# EAGLE design fb_up_2-4fach_tastsensor_mirr (EAGLE 5.00)
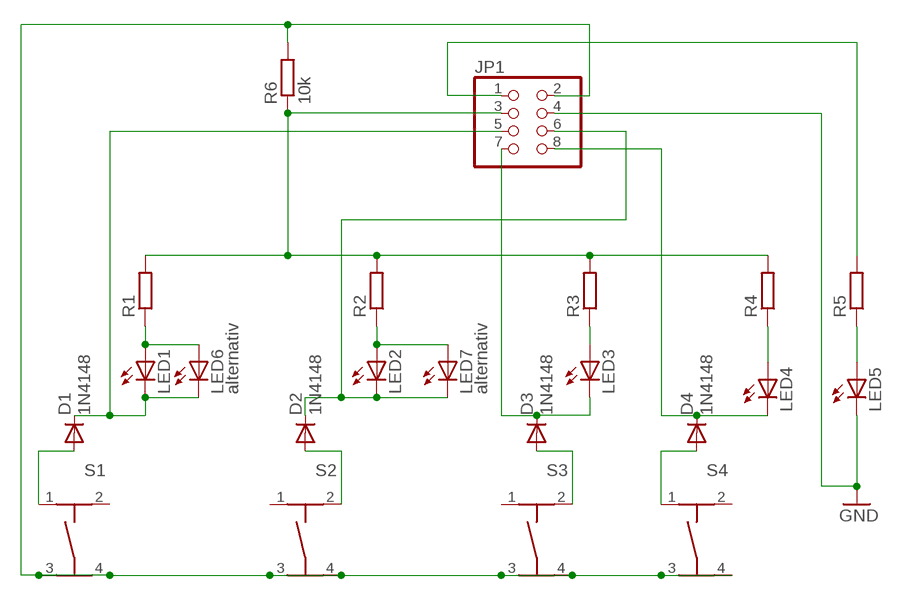
[diagram p0: schematic, sheet 1]

## Parts
D1  1N4148  [DO35-10]
D2  1N4148  [DO35-10]
D3  1N4148  [DO35-10]
D4  1N4148  [DO35-10]
JP1  PINHD-2X4  [2X04]
LED1  LED3MM  [LED3MM]
LED2  LED3MM  [LED3MM]
LED3  LED3MM  [LED3MM]
LED4  LED3MM  [LED3MM]
LED5  LED3MM  [LED3MM]
LED6  alternativ  LED3MM  [LED3MM]
LED7  alternativ  LED3MM  [LED3MM]
R1  R-EU_0204/7  [0204/7]
R2  R-EU_0204/7  [0204/7]
R3  R-EU_0204/7  [0204/7]
R4  R-EU_0204/7  [0204/7]
R5  R-EU_0204/7  [0204/7]
R6  10k  R-EU_0204/7  [0204/7]
S1  TASTER-9314_SMD  [TASTER-9314_SMD]
S2  TASTER-9314_SMD  [TASTER-9314_SMD]
S3  TASTER-9314_SMD  [TASTER-9314_SMD]
S4  TASTER-9314_SMD  [TASTER-9314_SMD]

## Nets
GND: JP1.4 LED5.K(C)
N$4: JP1.1 R5.2
N$5: LED1.A LED6.A R1.1
N$6: LED2.A LED7.A R2.1
N$7: LED3.A R3.1
N$8: LED4.A R4.1
N$9: LED5.A R5.1
N$10: JP1.3 R1.2 R2.2 R3.2 R4.2 R6.1
N$11: D1.C JP1.5 LED1.K(C) LED6.K(C)
N$12: D2.C JP1.6 LED2.K(C) LED7.K(C)
N$13: D1.A S1.1
N$14: D4.C JP1.8 LED4.K(C)
N$15: JP1.2 R6.2 S1.3 S1.4 S2.3 S2.4 S3.3 S3.4 S4.3 S4.4
N$17: D2.A S2.2
N$19: D3.C JP1.7 LED3.K(C)
N$21: D3.A S3.2
N$23: D4.A S4.1
Unconnected: S1.2 S2.1 S3.1 S4.2

## Library data of the parts
D1-D4 = diode:1N4148: DIODE high speed (Philips)
JP1 = pinhead:PINHD-2X4: PIN HEADER
LED1-LED7 = led:LED: LED OSRAM: - CHIPLED LG R971, LG N971, LY N971, LG Q971, LY Q971, LO R971, LY R971 LH N974, LH R974 LS Q976, LO Q976, LY Q976 LO Q996 - Hyper CHIPLED LW Q18S LB Q993, LB Q99A, LB R99A - SideLED LS A670, LO A670, LY A670, LG A670, LP A670 LB A673, LV A673, LT A673, LW A673 LH A674 LY A675 LS A676, LA A676, LO A676, LY A676, LW A676 LS A679, LY A679, LG A679 - Hyper Micro SIDELED® LS Y876, LA Y876, LO Y876, LY Y876 LT Y87S - SmartLED LW L88C, LW L88S LB L89C, LB L89S, LG L890 LS L89K, LO L89K, LY L89K LS L896, LA L896, LO L896, LY L896 - TOPLED LS T670, LO T670, LY T670, LG T670, LP T670 LSG T670, LSP T670, LSY T670, LOP T670, LYG T670 LG T671, LOG T671, LSG T671 LB T673, LV T673, LT T673, LW T673 LH T674 LS T676, LA T676, LO T676, LY T676, LB T676, LH T676, LSB T676, LW T676 LB T67C, LV T67C, LT T67C, LS T67K, LO T67K, LY T67K, LW E67C LS E67B, LA E67B, LO E67B, LY E67B, LB E67C, LV E67C, LT E67C LW T67C LS T679, LY T679, LG T679 LS T770, LO T770, LY T770, LG T770, LP T770 LB T773, LV T773, LT T773, LW T773 LH T774 LS E675, LA E675, LY E675, LS T675 LS T776, LA T776, LO T776, LY T776, LB T776 LHGB T686 LT T68C, LB T68C - Hyper Mini TOPLED® LB M676 - Mini TOPLED Santana® LG M470 LS M47K, LO M47K, LY M47K Source: http://www.osram.convergy.de/
R1-R6 = rcl:R-EU_: RESISTOR, European symbol
S1-S4 = Ergaenzung:TASTER-9314_SMD

## Board
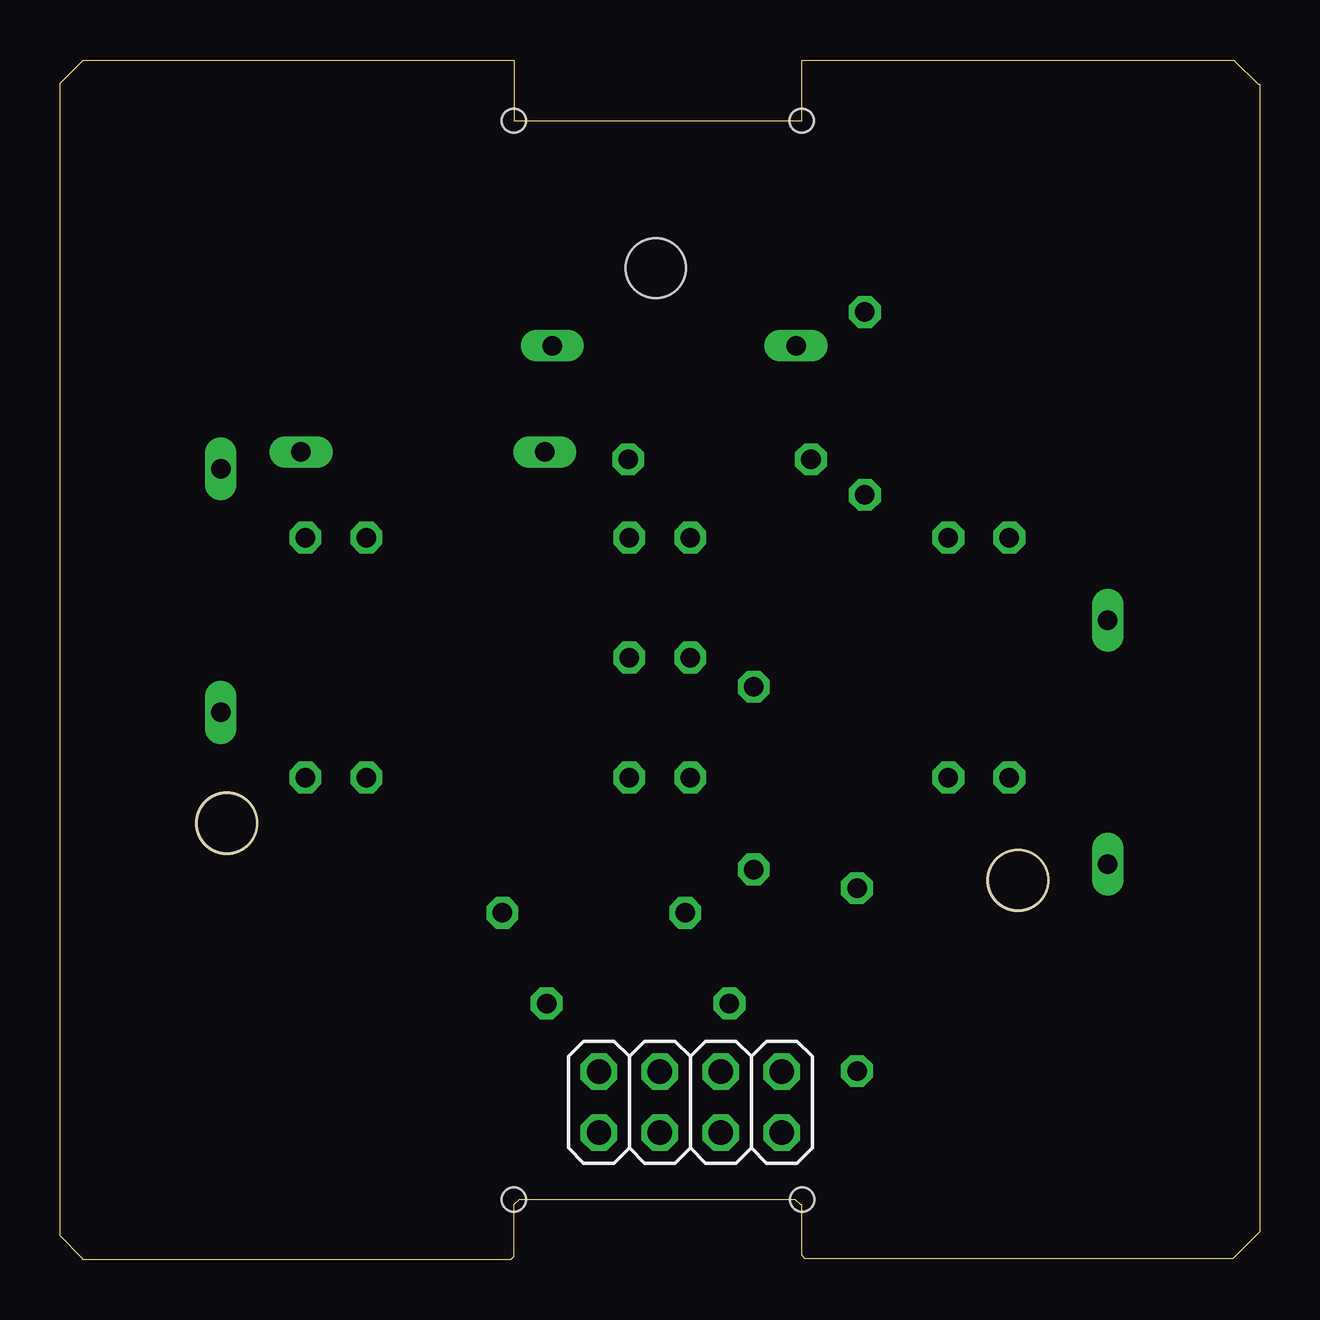
[diagram p1: board, top side]
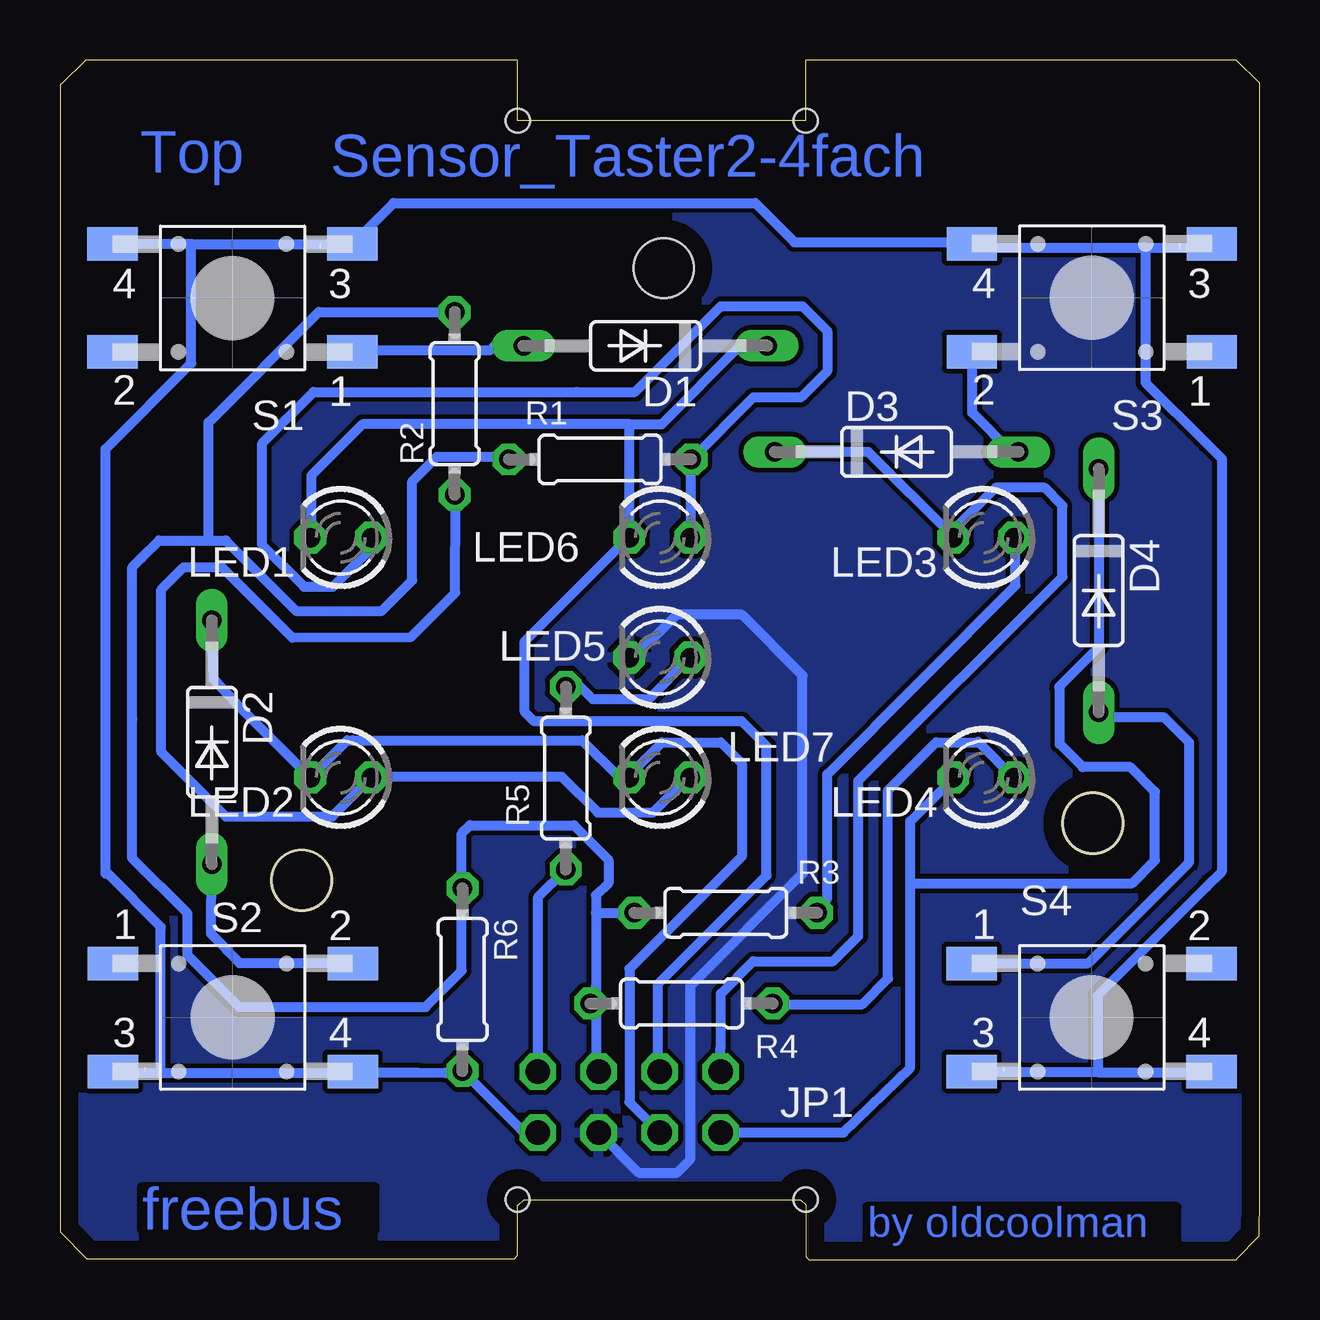
[diagram p2: board, bottom side, seen from below]

Size 50 x 50.01 mm. Coordinates in mm from the lower left corner, seen from the top.
Outline: 50,1.17 48.88,0.05 31.06,0.05 30.93,0.18 30.93,2.29 30.88,2.29 30.66,2.51 19.13,2.51 18.91,2.29 18.91,0.13 18.78,0 0.95,0 0.95,0.05 0.01,0.99 0,2.6 0,47.6 0,49.05 0.96,50.01 18.93,50.01 18.93,47.48 30.92,47.48 30.92,50.01 48.92,50.01 49.94,48.99 50,48.99 50,47.6 50,47.6 50,1.17
Outline: circle at 39.93,15.81 radius 1.3
Outline: circle at 6.95,18.2 radius 1.3
Copper layers (1*16): Top 0.035mm / dielectric 1.5mm / Bottom 0.035mm
Design rules "default *": minimum track width 10mil, minimum drill 24mil, track to track 8mil, track to pad 8mil, pad to pad 8mil, via to via 8mil, smd to smd 8mil, copper to edge 30mil, drill to drill 8mil, minimum pad ring 10mil, minimum via ring 8mil, stop-mask expansion 4mil, vias tented up to drill 0mil, thermal gap 10mil
Holes 2.5 mm at 24.84,41.33 39.93,15.82 6.95,18.2
Holes 1 mm at 30.91,47.48 18.92,47.48 30.93,2.51 18.92,2.51
tKeepout: area 16.2,46.6 to 33.7,47.6; area 0,2.7 to 4,47.6; area 0.1,2.6 to 50,3.6; area 45.8,2.7 to 50,47.6; area 39.6,40.9 to 45.9,47.5; area 36.2,44.3 to 39.6,47.6; area 34.5,45.8 to 36.2,47.6; area 43,37.5 to 45.8,40.9; area 44.6,36 to 45.8,37.5; area 41.4,39.2 to 42.9,40.8; area 37.9,42.5 to 39.6,44.3; area 40.8,3.5 to 45.9,10.3; 25 more areas; 10 lines
bKeepout: area 18.3,20.6 to 19.6,23.8; area 30.5,20.6 to 31.8,30.5; area 45,19.8 to 50,29.8; area 30.5,19.8 to 35.5,29.8; area 14.6,19.8 to 19.6,29.8; area 0,19.8 to 5,29.8; area 0,2.6 to 50,5.3; area 0,44.8 to 50,47.6; area 22.4,40.9 to 27.4,41.8; area 39.4,13.6 to 40.5,18; area 6.5,16 to 7.5,20.4; area 47.8,2.6 to 50,47.6; 1 more areas

### Footprints (pad centres in the part's own frame; a part is rotated, then mirrored left to right if it is on the bottom)
DO35-10 = drill 0.813 long: A 5.08,0; C -5.08,0
2X04 = drill 1.016 octagon: 1 -3.81,-1.27; 2 -3.81,1.27; 3 -1.27,-1.27; 4 -1.27,1.27; 5 1.27,-1.27; 6 1.27,1.27; 7 3.81,-1.27; 8 3.81,1.27
LED3MM = drill 0.813 octagon: A -1.27,0; K 1.27,0
0204/7 = drill 0.813 octagon: 1 -3.81,0; 2 3.81,0
TASTER-9314_SMD = smd 2.1 x 1.4: 1 -5,2.25; 2 5,2.25; 3 -5,-2.25; 4 5,-2.25

### Placement (x,y rotation side)
D1  25.6,38.09 180 bottom
D2  43.67,21.58 270 bottom
D3  15.13,33.67 0 bottom
D4  6.71,27.89 270 bottom
JP1  26.28,6.57 180 top
LED1  38.3,30.1 180 bottom
LED2  38.3,20.1 180 bottom
LED3  11.5,30.1 180 bottom
LED4  11.5,20.1 180 bottom
LED5  25,25.1 180 bottom
LED6  25,30.1 180 bottom
LED7  25,20.1 180 bottom
R1  27.49,33.36 180 bottom
R2  33.55,35.69 90 bottom
R3  22.25,14.46 180 bottom
R4  24.09,10.69 180 bottom
R5  28.91,20.08 270 bottom
R6  33.22,11.68 270 bottom
S1  42.81,40.09 180 bottom
S2  42.8,10.1 0 bottom
S3  6.99,40.1 180 bottom
S4  7,10.1 0 bottom

### Tracks (layer width: path | path; a pad name or v marks a point on that pad's centre or on a via)
GND
  Bottom 0.406: LED5.K 26.07,25.1 24.28,26.89 21.58,26.89 19.04,24.35 19.04,16.09 23.73,11.41 23.73,4.19 24.28,3.63 25.88,3.63 27.55,5.31 JP1.4
  pour Bottom: 50.95,50.94 -1.59,50.94 -1.59,-0.42 50.79,-0.42 50.79,31.41
N$1  (via drill 0.6)
  other vias: 24.87,41.33
N$2  (via drill 0.6)
  other vias: 39.93,15.81
N$3  (via drill 0.6)
  other vias: 6.95,18.2
N$4
  Bottom 0.406: R5.2 30.07,15.12 30.07,8.61 JP1.1
N$5
  Bottom 0.406: 36.92,30.12 37.02,30.12 LED1.A 37.06,30.13 | LED6.A 23.72,33.04 23.72,33.31 23.73,33.32 R1.1 21.11,35.94 19.12,35.94 18.01,37.05 18.01,38.72 19.04,39.75 22.46,39.75 26.04,36.17 28.46,36.17 39.44,36.17 41.57,34.03 41.57,29.8 39.83,28.05 38.62,28.05 37.06,29.62 37.06,30.13 | 37.06,30.13 37.06,30.21
N$6
  Bottom 0.406: LED7.A 23.72,20.09 23.72,19.98 23.94,19.98 25.29,18.64 27.58,18.64 29.09,20.14 36.99,20.14 LED2.A 38.65,18.48 43.09,18.48 45.78,21.16 45.78,27.93 44.84,28.87 43.25,28.87 40.32,25.94 35.36,25.97 33.53,27.79 33.51,31.67 33.55,31.83 R2.1
N$7
  Bottom 0.406: R3.1 18.02,15.07 18.02,20.23 10.17,28.11 10.17,30.04 LED3.A
N$8
  Bottom 0.406: R4.1 19.92,10.65 16.56,10.65 15.49,11.73 15.49,19.57 13.49,21.57 11.74,21.57 11.73,21.58 11.73,21.59 10.17,20.03 10.27,20.03 10.27,20.06 LED4.A
N$9
  Bottom 0.406: LED5.A 25.46,23.37 27.8,23.37 28.34,23.91 28.89,23.91 R5.1
N$10
  Bottom 0.406: 27.67,11.32 27.67,11.39 | JP1.3 27.67,8.35 27.67,11.32 | 27.67,11.32 R4.2 | 27.67,14.45 27.67,15.19 27.14,15.69 27.14,16.67 28.57,18.11 32.91,18.11 33.25,17.76 33.25,15.49 R6.1 | 27.67,14.45 27.67,11.32 | 27.67,14.45 27.49,14.45 | R3.2 26.79,14.45 27.67,14.45 | R1.2 31.3,33.43 31.35,33.48 34.28,33.48 35.32,32.45 35.32,28.32 36.59,27.05 40.16,27.05 43.09,29.98 43.81,29.98 | R2.2 39.21,39.5 43.81,34.91 43.81,29.98 | 43.81,29.98 45.87,29.98 46.59,29.27 | 46.59,29.27 | 46.59,29.27 46.98,28.87 46.98,22.52 46.98,16.73 44.68,14.43 44.68,12.68 42.54,10.54 34.76,10.54 33.25,12.05 33.25,15.46 R6.1 | R6.1
N$11
  Bottom 0.406: LED1.K 39.6,30.14 39.52,30.22 39.52,32.68 37.38,34.83 26.27,34.83 | 25.02,8.19 25.1,7.9 JP1.5 25,7.92 25.08,7.6 25.08,11.49 20.55,16.01 20.55,21.41 21.58,22.44 30.24,22.44 30.63,22.84 30.63,25.78 26.27,30.14 | D1.C 21.65,38.09 24.92,34.83 26.27,34.83 | 26.27,34.83 26.27,34.75 26.27,34.74 LED6.K 26.27,30.14 | 26.27,30.14
N$12
  Bottom 0.406: D2.C 43.6,24.19 42.64,23.17 LED2.K 38.28,21.39 38.03,21.65 37.8,21.65 28.23,21.65 26.72,20.14 26.3,20.14 26.3,20.13 LED7.K 26.27,20.22 24.92,21.57 22.46,21.57 21.58,20.7 21.58,16.81 26.27,12.13 26.27,6.57 25.07,5.38 JP1.6
N$13
  Bottom 0.406: S1.1 | S1.1 37.11,37.9 | D1.A 31.89,38.09 32.06,37.92 37.7,37.92 37.81,37.81 | 37.81,37.81 37.86,37.76 | S1.1 37.81,37.81
N$14
  Bottom 0.406: JP1.8 22.48,5.31 17.34,5.31 14.56,8.01 14.56,15.7 | D4.C 6.67,32.29 6.67,25.56 8.37,23.87 8.33,23.87 8.33,21.49 7.38,20.54 5.39,20.54 4.36,19.51 4.36,16.65 5.31,15.7 14.56,15.7 | LED4.K 12.77,20.07 14.56,18.27 14.56,15.7
N$15
  Bottom 0.406: S2.3 47.75,7.8 45.79,7.8 | 45.79,7.8 37.85,7.8 S2.4 36.73,7.81 35.08,7.81 33.96,7.8 33.16,7.8 33.16,7.81 R6.2 30.79,5.44 30.15,5.44 | 30.15,5.44 30.15,5.36 | 30.15,5.44 JP1.2 30.05,5.34 30.13,5.46 | 44.52,42.34 S1.4 | 44.52,42.34 S1.3 | S1.3 36.11,44.05 21.02,44.05 19.39,42.42 12.06,42.42 S3.4 11.82,42.18 4.84,42.18 | 1.82,42.18 1.81,42.18 | 1.82,42.18 S3.3 | 4.84,42.18 1.82,42.18 | S4.4 2.03,7.82 6.74,7.82 | 6.74,7.82 11.97,7.82 S4.3 9.98,7.85 | S1.3 38.28,42.34 | 4.84,42.18 4.84,42.21 4.76,42.13 4.76,36.57 2.22,34.03 1.58,33.4 1.58,16.17 2.22,15.54 | 44.52,42.34 44.52,37.37 48.1,33.79 48.1,16.09 48.02,16.09 45.79,13.87 45.79,7.8 | 2.22,15.54 | 2.22,15.54 6.74,11.01 6.74,7.82 | 2.22,15.54
N$17
  Bottom 0.406: S2.2 37.82,12.37 42.51,12.37 | 42.51,12.37 42.51,12.36 | D2.A 43.7,13.59 42.51,12.37
N$19
  Bottom 0.406: 22.55,7.76 JP1.7 22.47,8.86 22.46,8.87 22.46,11.09 21.11,12.44 17.77,12.44 16.73,13.49 16.73,19.97 8.21,28.46 8.21,31.43 8.96,32.18 11,32.18 12.72,30.46 12.72,30.15 LED3.K 12.77,30.14 16.3,33.67 D3.C
N$21
  Bottom 0.406: 11.82,37.68 S3.2 11.99,37.75 12.06,37.68 11.98,37.6 11.98,35.3 10.35,33.67 D3.A
N$23
  Bottom 0.406: 11.97,12.38 S4.1 12,12.31 11.98,12.28 11.9,12.36 7.14,12.36 2.93,16.57 2.93,21.57 3.96,22.6 6.74,22.6 6.71,22.58 D4.A

### Text on the board
Bottom: Sensor_Taster2-4fach | Top | by oldcoolman | freebus